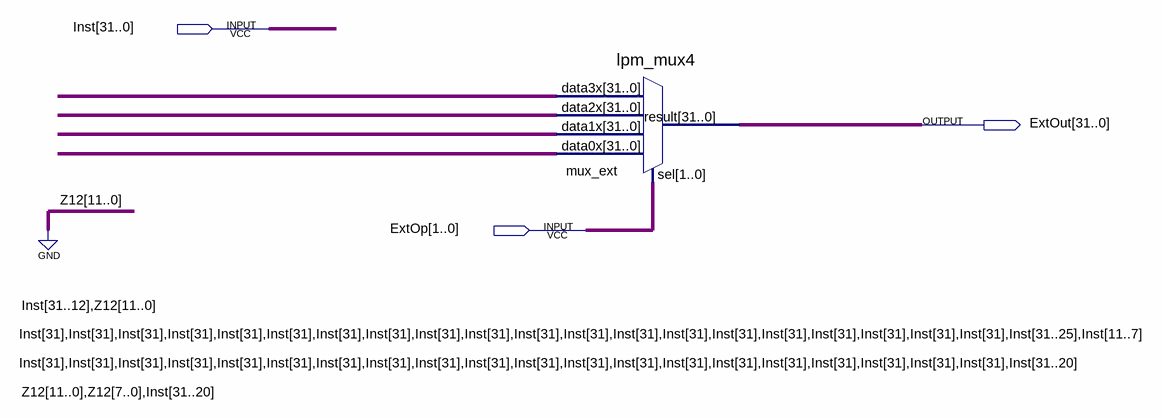
[diagram p0: schematic sheet]
// Quartus schematic ExtU.bdf as structural Verilog: 1 symbols, 3 pins
module ExtU (
  input  [31:0] Inst,
  input  [1:0] ExtOp,
  output [31:0] ExtOut
);

  lpm_mux4 mux_ext (
    .data3x({Inst[31:12], {12{1'b0}}}), .data2x({{21{Inst[31]}}, Inst[30:25], Inst[11:7]}),
    .data1x({{21{Inst[31]}}, Inst[30:20]}), .data0x({{20{1'b0}}, Inst[31:20]}), .sel(ExtOp), .result(ExtOut));
endmodule
